# EAGLE schematic ComputeCalculator (EAGLE 7.2.0)

## Sheet 1 of 5
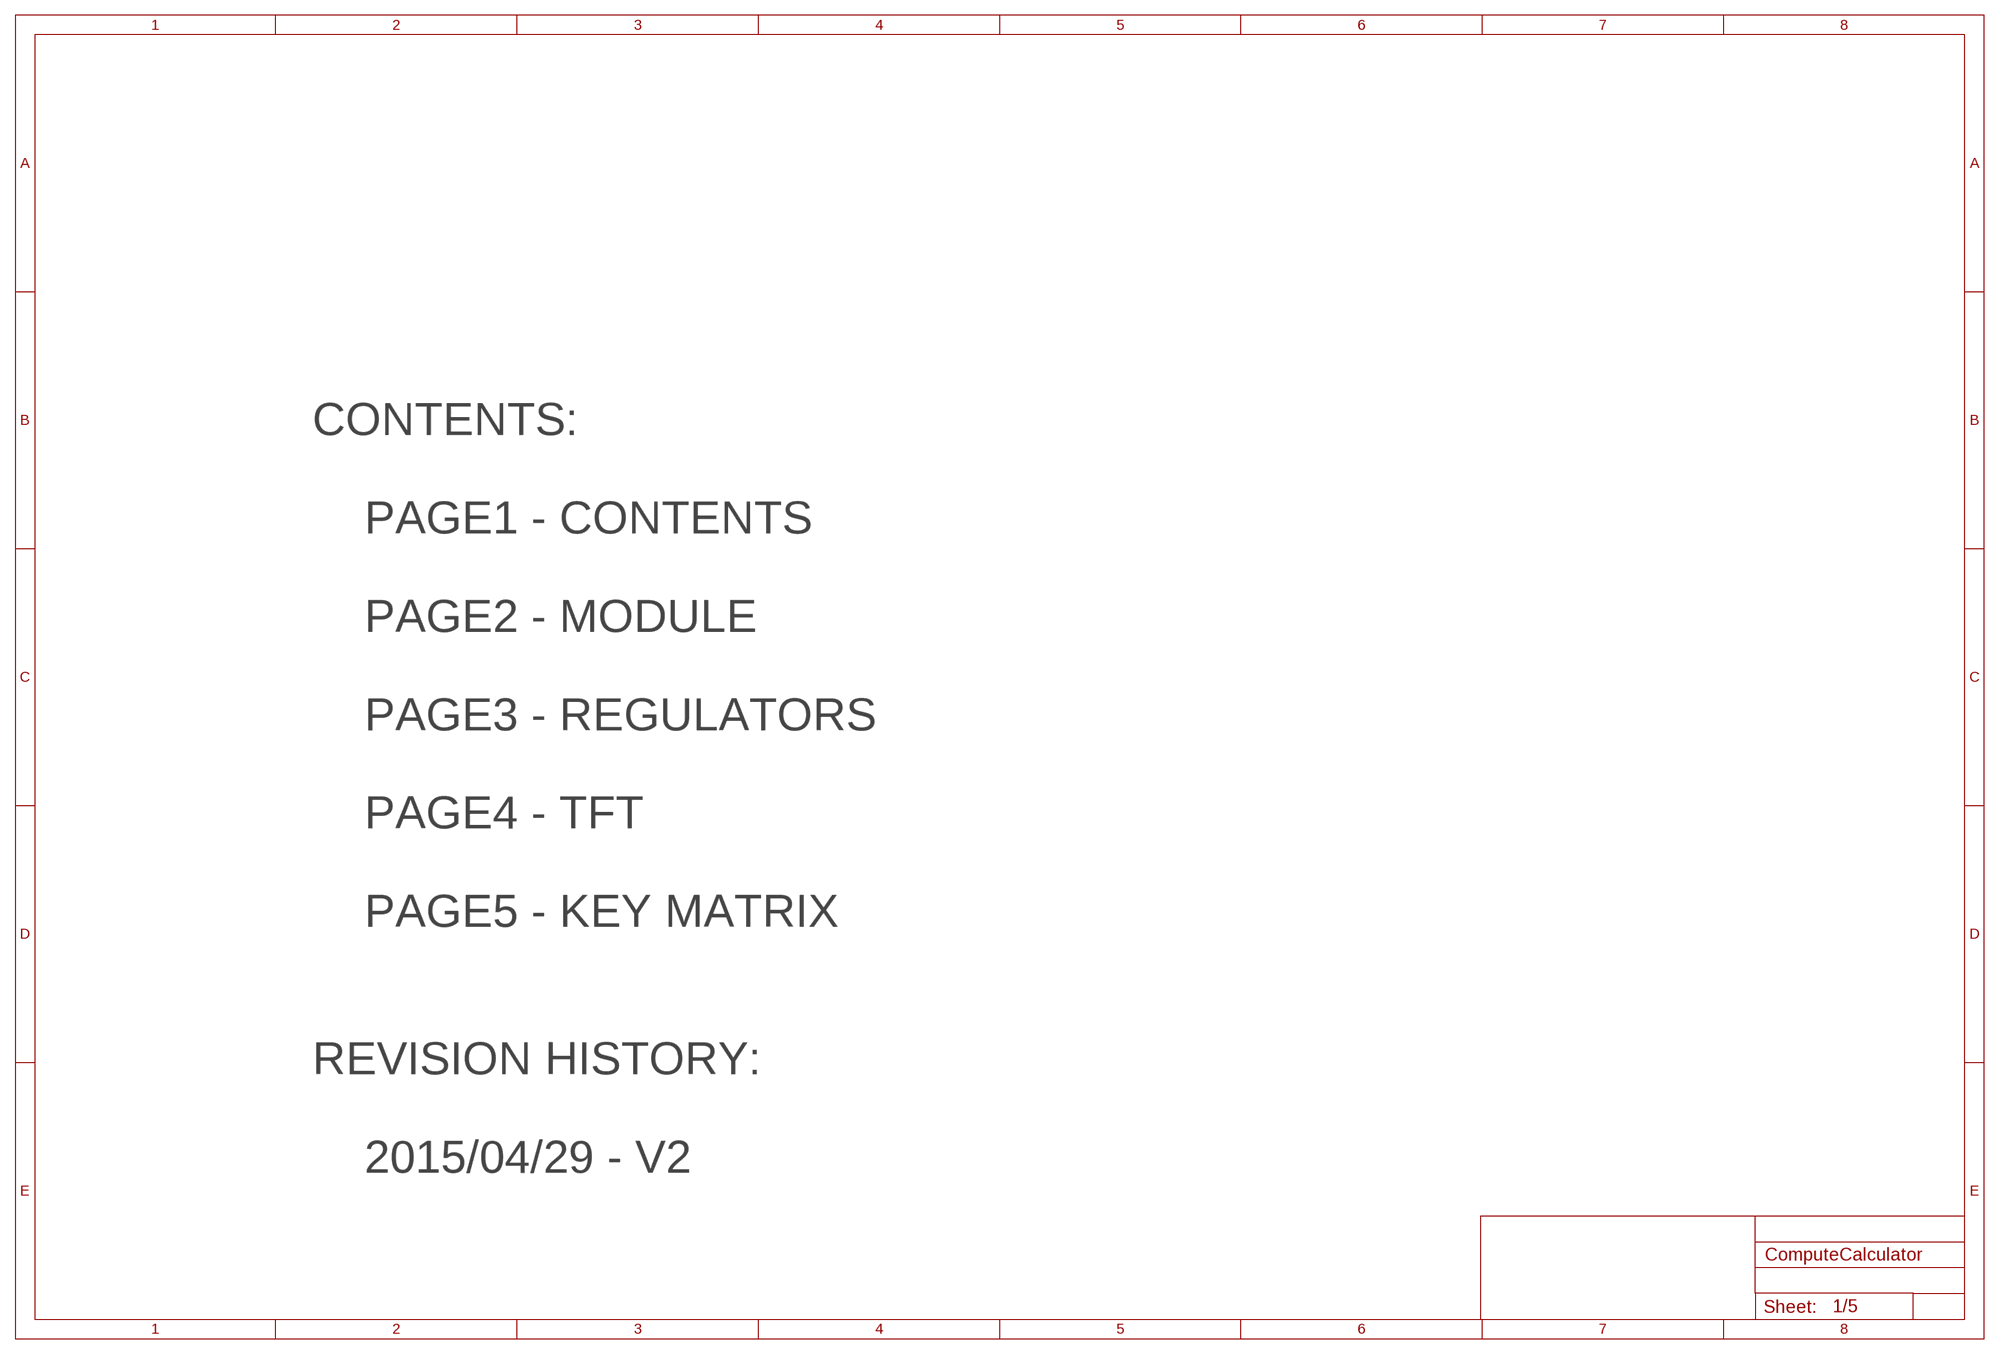
[diagram p0: schematic, sheet 1]

### Notes on the sheet
- CONTENTS:
  
      PAGE1 - CONTENTS
  
      PAGE2 - MODULE
  
      PAGE3 - REGULATORS
  
      PAGE4 - TFT
   
      PAGE5 - KEY MATRIX
  
  
  REVISION HISTORY:
  
      2015/04/29 - V2

## Sheet 2 of 5
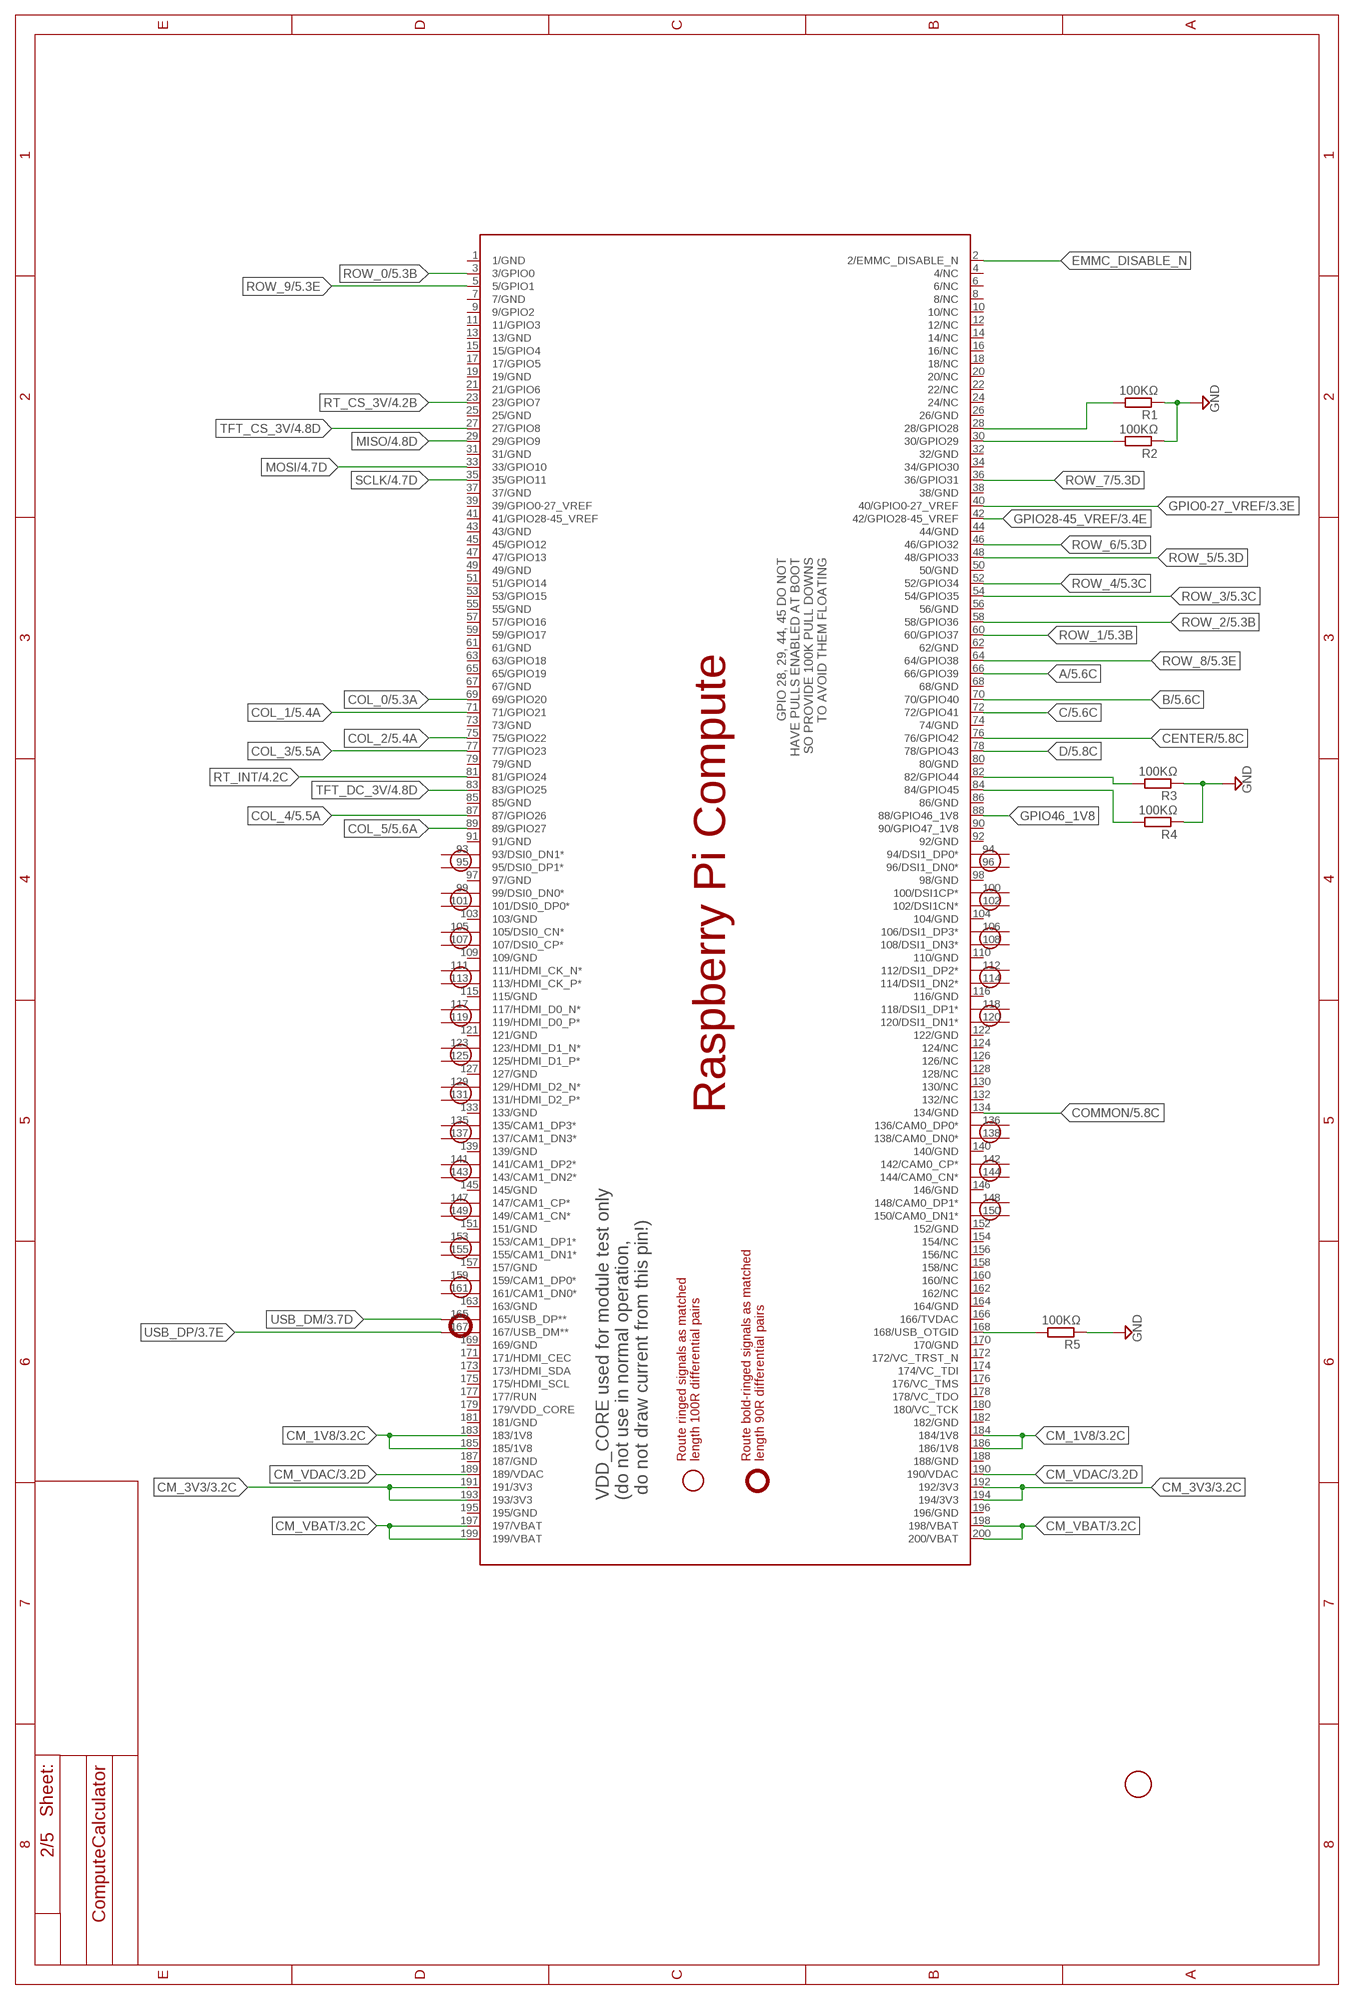
[diagram p1: schematic, sheet 2]

### Parts
$$PCB100  RPI_COMPUTE  [RPI_COMPUTE]
$$U$1  FIDUCIAL  [FIDUCIAL_1MM]
R1  100KΩ  R-EU_M1206  [M1206]
R2  100KΩ  R-EU_M1206  [M1206]
R3  100KΩ  R-EU_M1206  [M1206]
R4  100KΩ  R-EU_M1206  [M1206]
R5  100KΩ  R-EU_M1206  [M1206]

### Nets
A: $$PCB100.66(66/GPIO39) ; also sheet 5
B: $$PCB100.70(70/GPIO40) ; also sheet 5
C: $$PCB100.72(72/GPIO41) ; also sheet 5
CENTER: $$PCB100.76(76/GPIO42) ; also sheet 5
CM_1V8: $$PCB100.183(183/1V8) $$PCB100.184(184/1V8) $$PCB100.185(185/1V8) $$PCB100.186(186/1V8) ; also sheet 3
CM_3V3: $$PCB100.191(191/3V3) $$PCB100.192(192/3V3) $$PCB100.193(193/3V3) $$PCB100.194(194/3V3) ; also sheet 3
CM_VBAT: $$PCB100.197(197/VBAT) $$PCB100.198(198/VBAT) $$PCB100.199(199/VBAT) $$PCB100.200(200/VBAT) ; also sheet 3
CM_VDAC: $$PCB100.189(189/VDAC) $$PCB100.190(190/VDAC) ; also sheet 3
COL_0: $$PCB100.69(69/GPIO20) ; also sheet 5
COL_1: $$PCB100.71(71/GPIO21) ; also sheet 5
COL_2: $$PCB100.75(75/GPIO22) ; also sheet 5
COL_3: $$PCB100.77(77/GPIO23) ; also sheet 5
COL_4: $$PCB100.87(87/GPIO26) ; also sheet 5
COL_5: $$PCB100.89(89/GPIO27) ; also sheet 5
COMMON: $$PCB100.134(134/GND) ; also sheet 5
D: $$PCB100.78(78/GPIO43) ; also sheet 5
EMMC_DISABLE_N: $$PCB100.2(2/EMMC_DISABLE_N)
GND: R1.1 R2.1 R3.1 R4.1 R5.1 ; also sheet 3,4
GPIO0-27_VREF: $$PCB100.40(40/GPIO0-27_VREF) ; also sheet 3
GPIO28-45_VREF: $$PCB100.42(42/GPIO28-45_VREF) ; also sheet 3
GPIO46_1V8: $$PCB100.88(88/GPIO46_1V8)
MISO: $$PCB100.29(29/GPIO9) ; also sheet 4
MOSI: $$PCB100.33(33/GPIO10) ; also sheet 4
N$19: $$PCB100.28(28/GPIO28) R1.2
N$24: $$PCB100.82(82/GPIO44) R3.2
N$25: $$PCB100.84(84/GPIO45) R4.2
N$30: $$PCB100.168(168/USB_OTGID) R5.2
N$31: $$PCB100.30(30/GPIO29) R2.2
ROW_0: $$PCB100.3(3/GPIO0) ; also sheet 5
ROW_1: $$PCB100.60(60/GPIO37) ; also sheet 5
ROW_2: $$PCB100.58(58/GPIO36) ; also sheet 5
ROW_3: $$PCB100.54(54/GPIO35) ; also sheet 5
ROW_4: $$PCB100.52(52/GPIO34) ; also sheet 5
ROW_5: $$PCB100.48(48/GPIO33) ; also sheet 5
ROW_6: $$PCB100.46(46/GPIO32) ; also sheet 5
ROW_7: $$PCB100.36(36/GPIO31) ; also sheet 5
ROW_8: $$PCB100.64(64/GPIO38) ; also sheet 5
ROW_9: $$PCB100.5(5/GPIO1) ; also sheet 5
RT_CS_3V: $$PCB100.23(23/GPIO7) ; also sheet 4
RT_INT: $$PCB100.81(81/GPIO24) ; also sheet 4
SCLK: $$PCB100.35(35/GPIO11) ; also sheet 4
TFT_CS_3V: $$PCB100.27(27/GPIO8) ; also sheet 4
TFT_DC_3V: $$PCB100.83(83/GPIO25) ; also sheet 4
USB_DM: $$PCB100.165(165/USB_DP**) ; also sheet 3
USB_DP: $$PCB100.167(167/USB_DM**) ; also sheet 3
Unconnected: $$PCB100.1(1/GND) $$PCB100.4(4/NC) $$PCB100.6(6/NC) $$PCB100.7(7/GND) $$PCB100.8(8/NC) $$PCB100.9(9/GPIO2) $$PCB100.10(10/NC) $$PCB100.11(11/GPIO3) $$PCB100.12(12/NC) $$PCB100.13(13/GND) $$PCB100.14(14/NC) $$PCB100.15(15/GPIO4) $$PCB100.16(16/NC) $$PCB100.17(17/GPIO5) $$PCB100.18(18/NC) $$PCB100.19(19/GND) $$PCB100.20(20/NC) $$PCB100.21(21/GPIO6) $$PCB100.22(22/NC) $$PCB100.24(24/NC) $$PCB100.25(25/GND) $$PCB100.26(26/GND) $$PCB100.31(31/GND) $$PCB100.32(32/GND) $$PCB100.34(34/GPIO30) $$PCB100.37(37/GND) $$PCB100.38(38/GND) $$PCB100.39(39/GPIO0-27_VREF) $$PCB100.41(41/GPIO28-45_VREF) $$PCB100.43(43/GND) $$PCB100.44(44/GND) $$PCB100.45(45/GPIO12) $$PCB100.47(47/GPIO13) $$PCB100.49(49/GND) $$PCB100.50(50/GND) $$PCB100.51(51/GPIO14) $$PCB100.53(53/GPIO15) $$PCB100.55(55/GND) $$PCB100.56(56/GND) $$PCB100.57(57/GPIO16) $$PCB100.59(59/GPIO17) $$PCB100.61(61/GND) $$PCB100.62(62/GND) $$PCB100.63(63/GPIO18) $$PCB100.65(65/GPIO19) $$PCB100.67(67/GND) $$PCB100.68(68/GND) $$PCB100.73(73/GND) $$PCB100.74(74/GND) $$PCB100.79(79/GND) $$PCB100.80(80/GND) $$PCB100.85(85/GND) $$PCB100.86(86/GND) $$PCB100.90(90/GPIO47_1V8) $$PCB100.91(91/GND) $$PCB100.92(92/GND) $$PCB100.93(93/DSI0_DN1*) $$PCB100.94(94/DSI1_DP0*) $$PCB100.95(95/DSI0_DP1*) $$PCB100.96(96/DSI1_DN0*) $$PCB100.97(97/GND) $$PCB100.98(98/GND) $$PCB100.99(99/DSI0_DN0*) $$PCB100.100(100/DSI1CP*) $$PCB100.101(101/DSI0_DP0*) $$PCB100.102(102/DSI1CN*) $$PCB100.103(103/GND) $$PCB100.104(104/GND) $$PCB100.105(105/DSI0_CN*) $$PCB100.106(106/DSI1_DP3*) $$PCB100.107(107/DSI0_CP*) $$PCB100.108(108/DSI1_DN3*) $$PCB100.109(109/GND) $$PCB100.110(110/GND) $$PCB100.111(111/HDMI_CK_N*) $$PCB100.112(112/DSI1_DP2*) $$PCB100.113(113/HDMI_CK_P*) $$PCB100.114(114/DSI1_DN2*) $$PCB100.115(115/GND) $$PCB100.116(116/GND) $$PCB100.117(117/HDMI_D0_N*) $$PCB100.118(118/DSI1_DP1*) $$PCB100.119(119/HDMI_D0_P*) $$PCB100.120(120/DSI1_DN1*) $$PCB100.121(121/GND) $$PCB100.122(122/GND) $$PCB100.123(123/HDMI_D1_N*) $$PCB100.124(124/NC) $$PCB100.125(125/HDMI_D1_P*) $$PCB100.126(126/NC) $$PCB100.127(127/GND) $$PCB100.128(128/NC) $$PCB100.129(129/HDMI_D2_N*) $$PCB100.130(130/NC) $$PCB100.131(131/HDMI_D2_P*) $$PCB100.132(132/NC) $$PCB100.133(133/GND) $$PCB100.135(135/CAM1_DP3*) $$PCB100.136(136/CAM0_DP0*) $$PCB100.137(137/CAM1_DN3*) $$PCB100.138(138/CAM0_DN0*) $$PCB100.139(139/GND) $$PCB100.140(140/GND) $$PCB100.141(141/CAM1_DP2*) $$PCB100.142(142/CAM0_CP*) $$PCB100.143(143/CAM1_DN2*) $$PCB100.144(144/CAM0_CN*) $$PCB100.145(145/GND) $$PCB100.146(146/GND) $$PCB100.147(147/CAM1_CP*) $$PCB100.148(148/CAM0_DP1*) $$PCB100.149(149/CAM1_CN*) $$PCB100.150(150/CAM0_DN1*) $$PCB100.151(151/GND) $$PCB100.152(152/GND) $$PCB100.153(153/CAM1_DP1*) $$PCB100.154(154/NC) $$PCB100.155(155/CAM1_DN1*) $$PCB100.156(156/NC) $$PCB100.157(157/GND) $$PCB100.158(158/NC) $$PCB100.159(159/CAM1_DP0*) $$PCB100.160(160/NC) $$PCB100.161(161/CAM1_DN0*) $$PCB100.162(162/NC) $$PCB100.163(163/GND) $$PCB100.164(164/GND) $$PCB100.166(166/TVDAC) $$PCB100.169(169/GND) $$PCB100.170(170/GND) $$PCB100.171(171/HDMI_CEC) $$PCB100.172(172/VC_TRST_N) $$PCB100.173(173/HDMI_SDA) $$PCB100.174(174/VC_TDI) $$PCB100.175(175/HDMI_SCL) $$PCB100.176(176/VC_TMS) $$PCB100.177(177/RUN) $$PCB100.178(178/VC_TDO) $$PCB100.179(179/VDD_CORE) $$PCB100.180(180/VC_TCK) $$PCB100.181(181/GND) $$PCB100.182(182/GND) $$PCB100.187(187/GND) $$PCB100.188(188/GND) $$PCB100.195(195/GND) $$PCB100.196(196/GND)

### Notes on the sheet
- GPIO 28, 29, 44, 45 DO NOT
  HAVE PULLS ENABLED AT BOOT
  SO PROVIDE 100K PULL DOWNS
  TO AVOID THEM FLOATING
- VDD_CORE used for module test only
  (do not use in normal operation,
   do not draw current from this pin!)

## Sheet 3 of 5
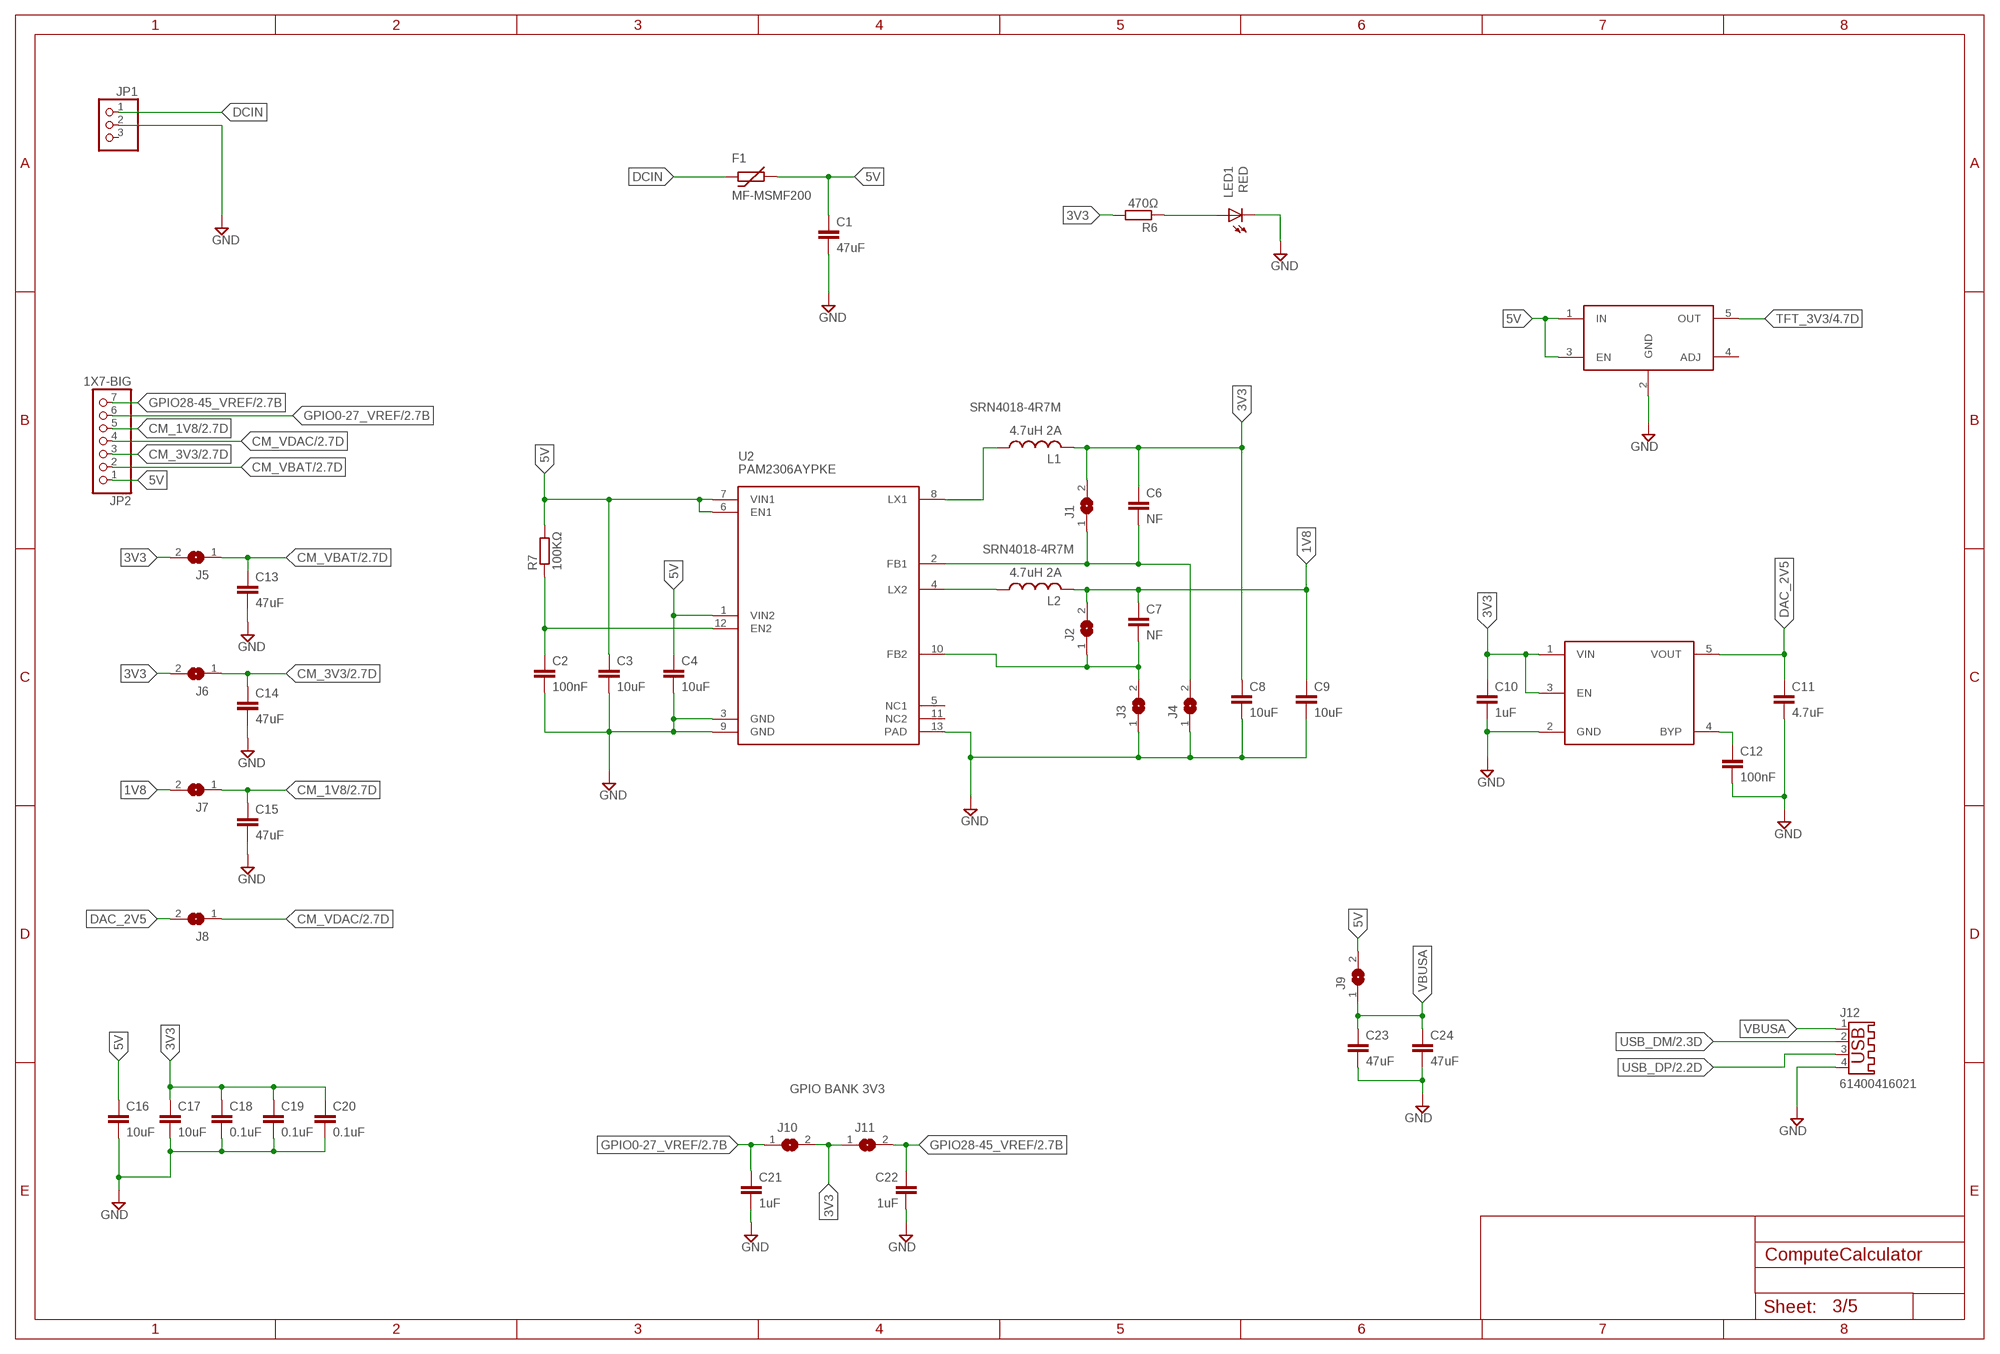
[diagram p2: schematic, sheet 3]

### Parts
C1  47uF  CAPACITOR  [C0603]
C2  100nF  C-EUC1206  [C1206]
C3  10uF  C-EUC1206  [C1206]
C4  10uF  C-EUC1206  [C1206]
C6  NF  C-EUC1206  [C1206]
C7  NF  C-EUC1206  [C1206]
C8  10uF  C-EUC1206  [C1206]
C9  10uF  C-EUC1206  [C1206]
C10  1uF  C-EUC1206  [C1206]
C11  4.7uF  C-EUC1206  [C1206]
C12  100nF  C-EUC1206  [C1206]
C13  47uF  C-EUC1206  [C1206]
C14  47uF  C-EUC1206  [C1206]
C15  47uF  C-EUC1206  [C1206]
C16  10uF  C-EUC1206  [C1206]
C17  10uF  C-EUC1206  [C1206]
C18  0.1uF  C-EUC1206  [C1206]
C19  0.1uF  C-EUC1206  [C1206]
C20  0.1uF  C-EUC1206  [C1206]
C21  1uF  C-EUC1206  [C1206]
C22  1uF  C-EUC1206  [C1206]
C23  47uF  C-EUC1206  [C1206]
C24  47uF  C-EUC1206  [C1206]
F1  MF-MSMF200  [MF-MSMF200]
J1  JUMPER  [SJW]
J2  JUMPER  [SJW]
J3  JUMPER  [SJW]
J4  JUMPER  [SJW]
J5  JUMPER  [SJW]
J6  JUMPER  [SJW]
J7  JUMPER  [SJW]
J8  JUMPER  [SJW]
J9  JUMPER  [SJW]
J10  JUMPER  [SJW]
J11  JUMPER  [SJW]
J12  61400416021  USB-A003  [USB-A003]
JP1  PINHD-1X3  [1X03]
JP2  1X7-BIG  [1X7-BIG]
L1  SRN4018-4R7M  L-USWE-TPC  [POWER-CHOKE_WE-TPC]
L2  SRN4018-4R7M  L-USWE-TPC  [POWER-CHOKE_WE-TPC]
LED1  RED  LEDCHIP-LED0805  [CHIP-LED0805]
R6  470Ω  R-EU_M1206  [M1206]
R7  100KΩ  R-EU_M1206  [M1206]
U1  MIC5225  [SOT-25]
U2  PAM2306AYPKE  [WDFN_12L]
U3  AP7115-25SEG  [SOT-25]

### Nets
1V8: C7.1 C9.1 J2.2 J7.2 L2.2
3V3: C6.1 C8.1 C10.1 C17.1 C18.1 C19.1 C20.1 J1.2 J5.2 J6.2 J10.2 J11.1 L1.2 R6.2 U3.1(VIN) U3.3(EN)
5V: C1.1 C3.1 C4.1 C16.1 F1.P$2 J9.2 JP2.1 R7.2 U1.1(IN) U1.3(EN) U2.1(VIN2) U2.6(EN1) U2.7(VIN1)
CM_1V8: C15.1 J7.1 JP2.5 ; also sheet 2
CM_3V3: C14.1 J6.1 JP2.3 ; also sheet 2
CM_VBAT: C13.1 J5.1 JP2.2 ; also sheet 2
CM_VDAC: J8.1 JP2.4 ; also sheet 2
DAC_2V5: C11.1 J8.2 U3.5(VOUT)
DCIN: F1.P$1 JP1.1
GND: C1.2 C2.2 C3.2 C4.2 C8.2 C9.2 C10.2 C11.2 C12.2 C13.2 C14.2 C15.2 C16.2 C17.2 C18.2 C19.2 C20.2 C21.2 C22.2 C23.2 C24.2 J3.1 J4.1 J12.4 JP1.2 LED1.C U1.2(GND) U2.3(GND) U2.9(GND) U2.13(PAD) U3.2(GND) ; also sheet 2,4
GPIO0-27_VREF: C21.1 J10.1 JP2.6 ; also sheet 2
GPIO28-45_VREF: C22.1 J11.2 JP2.7 ; also sheet 2
N$1: C6.2 J1.1 J4.2 U2.2(FB1)
N$2: LED1.A R6.1
N$3: C2.1 R7.1 U2.12(EN2)
N$5: C7.2 J2.1 J3.2 U2.10(FB2)
N$6: L1.1 U2.8(LX1)
N$7: L2.1 U2.4(LX2)
N$9: C12.1 U3.4(BYP)
TFT_3V3: U1.5(OUT) ; also sheet 4
USB_DM: J12.2 ; also sheet 2
USB_DP: J12.3 ; also sheet 2
VBUSA: C23.1 C24.1 J9.1 J12.1
Unconnected: JP1.3 U1.4(ADJ) U2.5(NC1) U2.11(NC2)

### Notes on the sheet
- 4.7uH 2A
- 4.7uH 2A
- GPIO BANK 3V3

## Sheet 4 of 5
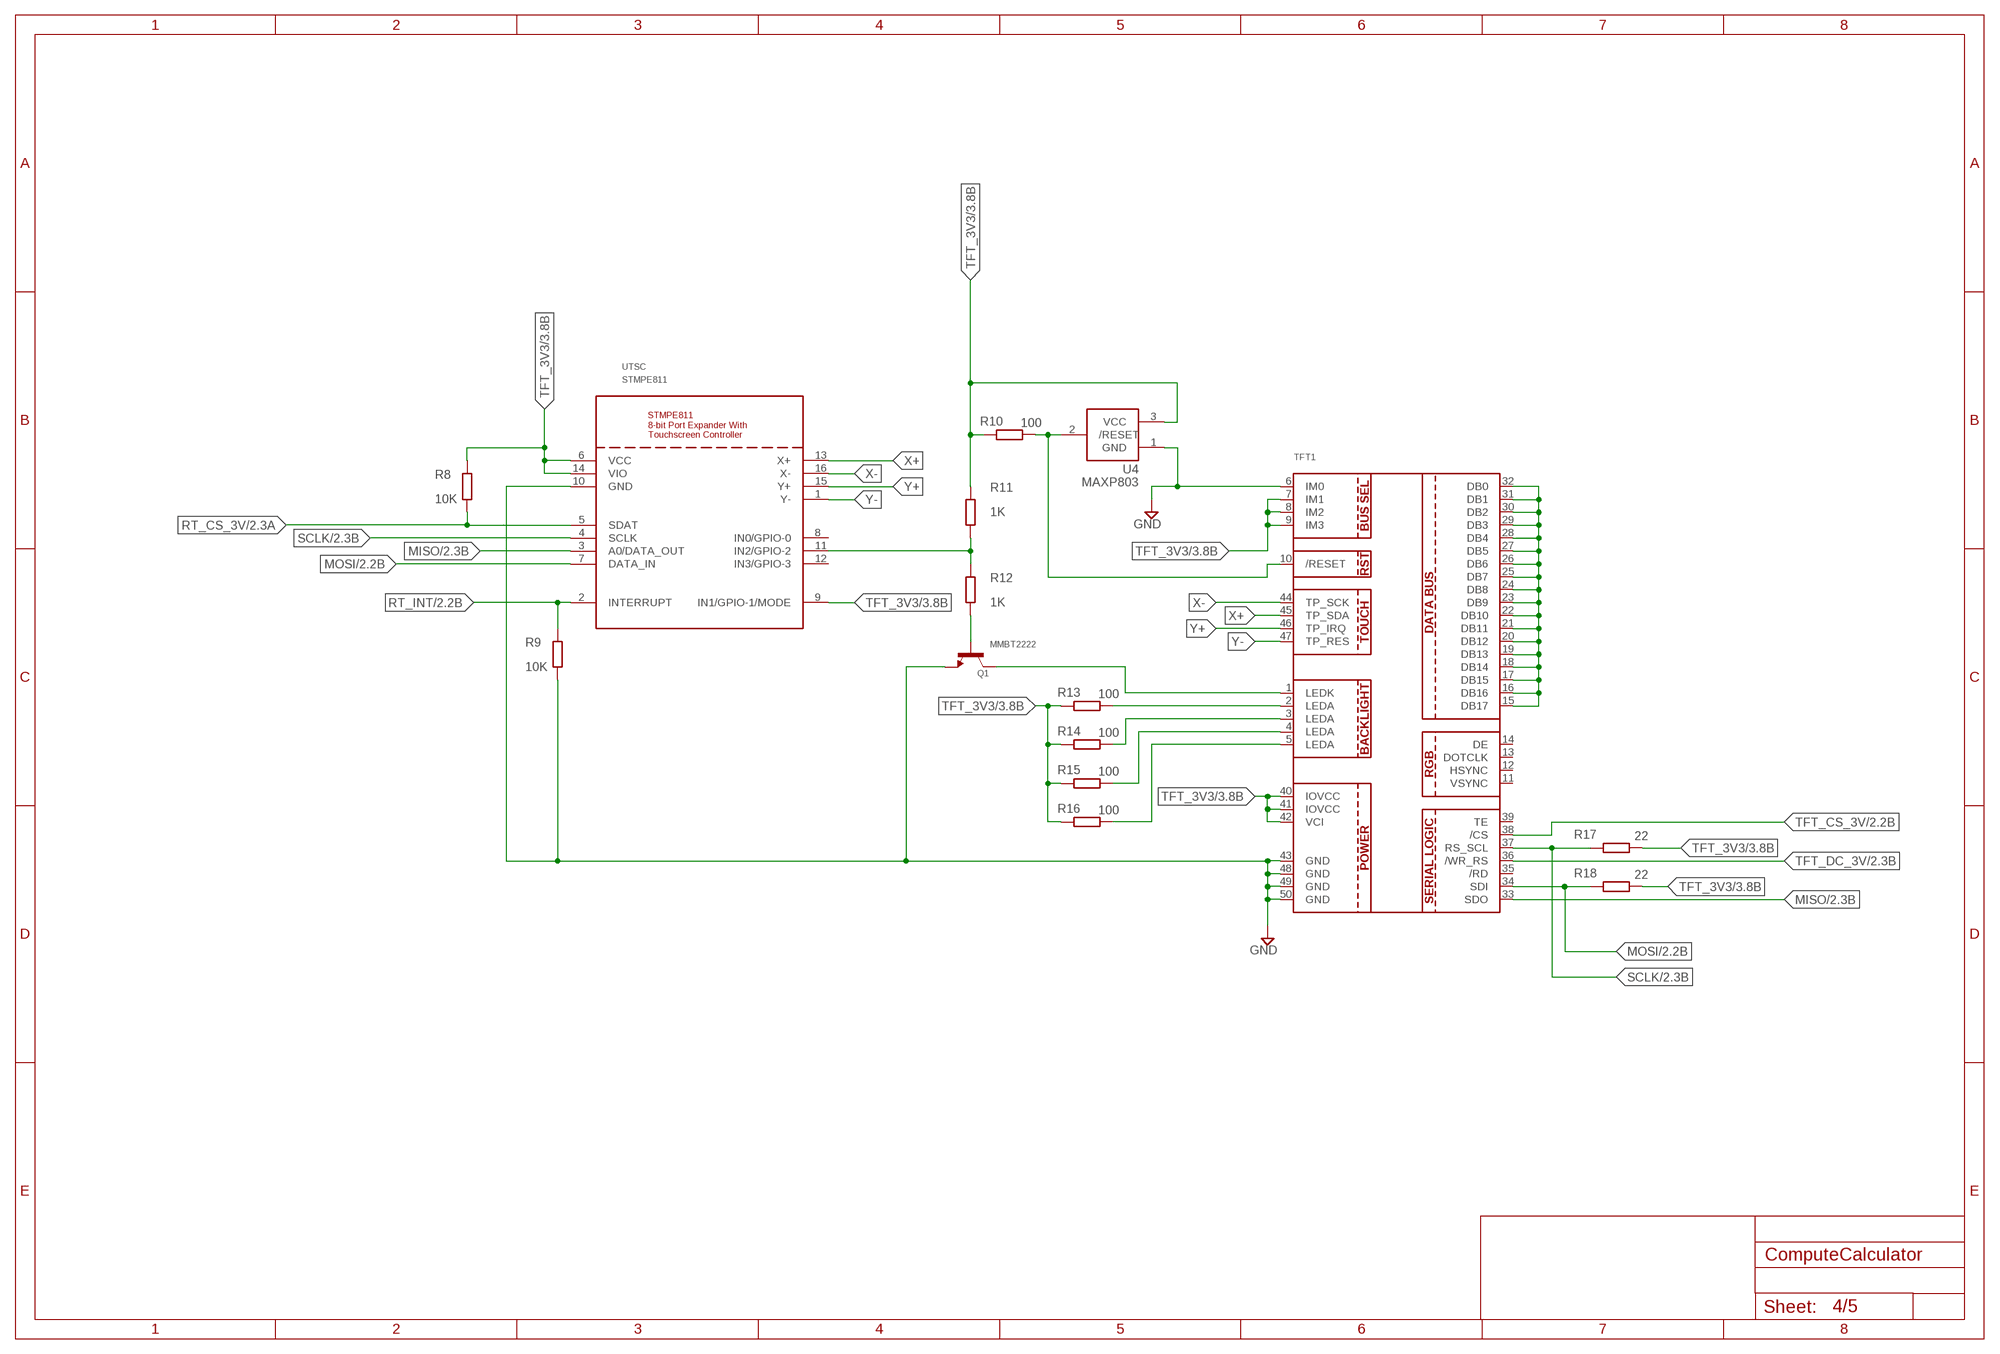
[diagram p3: schematic, sheet 4]

### Parts
Q1  MMBT2222  TRANSISTOR_NPNWIDE  [SOT23-WIDE]
R8  10K  R-EU_M1206  [M1206]
R9  10K  R-EU_M1206  [M1206]
R10  100  R-EU_M1206  [M1206]
R11  1K  R-EU_M1206  [M1206]
R12  1K  R-EU_M1206  [M1206]
R13  100  R-EU_M1206  [M1206]
R14  100  R-EU_M1206  [M1206]
R15  100  R-EU_M1206  [M1206]
R16  100  R-EU_M1206  [M1206]
R17  22  R-EU_M1206  [M1206]
R18  22  R-EU_M1206  [M1206]
TFT1  DISP_LCD_CTP28_DATASHEET  [TFT_CTP28]
U4  MAXP803  AXP083-SAG  [SOT23]
UTSC  STMPE811  [QFN16L]

### Nets
GND: Q1.2(E) R9.2 TFT1.6(IM0) TFT1.43(GND) TFT1.48(GND) TFT1.49(GND) TFT1.50(GND) U4.1(GND) UTSC.10(GND) ; also sheet 2,3
MISO: TFT1.33(SDO) UTSC.3(A0/DATA_OUT) ; also sheet 2
MOSI: R18.2 TFT1.34(SDI) UTSC.7(DATA_IN) ; also sheet 2
N$8: Q1.3(C) TFT1.1(LEDK)
N$11: R11.2 R12.1 UTSC.11(IN2/GPIO-2)
N$12: Q1.1(B) R12.2
N$26: R13.1 TFT1.2(LEDA)
N$27: R14.1 TFT1.3(LEDA)
N$28: R15.1 TFT1.4(LEDA)
N$32: TFT1.15(DB17) TFT1.16(DB16) TFT1.17(DB15) TFT1.18(DB14) TFT1.19(DB13) TFT1.20(DB12) TFT1.21(DB11) TFT1.22(DB10) TFT1.23(DB9) TFT1.24(DB8) TFT1.25(DB7) TFT1.26(DB6) TFT1.27(DB5) TFT1.28(DB4) TFT1.29(DB3) TFT1.30(DB2) TFT1.31(DB1) TFT1.32(DB0)
R16: R16.1 TFT1.5(LEDA)
RT_CS_3V: R8.2 UTSC.5(SDAT) ; also sheet 2
RT_INT: R9.1 UTSC.2(INTERRUPT) ; also sheet 2
SCLK: R17.2 TFT1.37(RS_SCL) UTSC.4(SCLK) ; also sheet 2
TFT_3V3: R8.1 R10.2 R11.1 R13.2 R14.2 R15.2 R16.2 R17.1 R18.1 TFT1.7(IM1) TFT1.8(IM2) TFT1.9(IM3) TFT1.40(IOVCC) TFT1.41(IOVCC) TFT1.42(VCI) U4.3(VCC) UTSC.6(VCC) UTSC.9(IN1/GPIO-1/MODE) UTSC.14(VIO) ; also sheet 3
TFT_CS_3V: TFT1.38(/CS) ; also sheet 2
TFT_DC_3V: TFT1.36(/WR_RS) ; also sheet 2
TFT_RESET: R10.1 TFT1.10(/RESET) U4.2(/RESET)
X+: TFT1.45(TP_SDA) UTSC.13(X+)
X-: TFT1.44(TP_SCK) UTSC.16(X-)
Y+: TFT1.46(TP_IRQ) UTSC.15(Y+)
Y-: TFT1.47(TP_RES) UTSC.1(Y-)
Unconnected: TFT1.11(VSYNC) TFT1.12(HSYNC) TFT1.13(DOTCLK) TFT1.14(DE) TFT1.35(/RD) TFT1.39(TE) UTSC.8(IN0/GPIO-0) UTSC.12(IN3/GPIO-3)

## Sheet 5 of 5
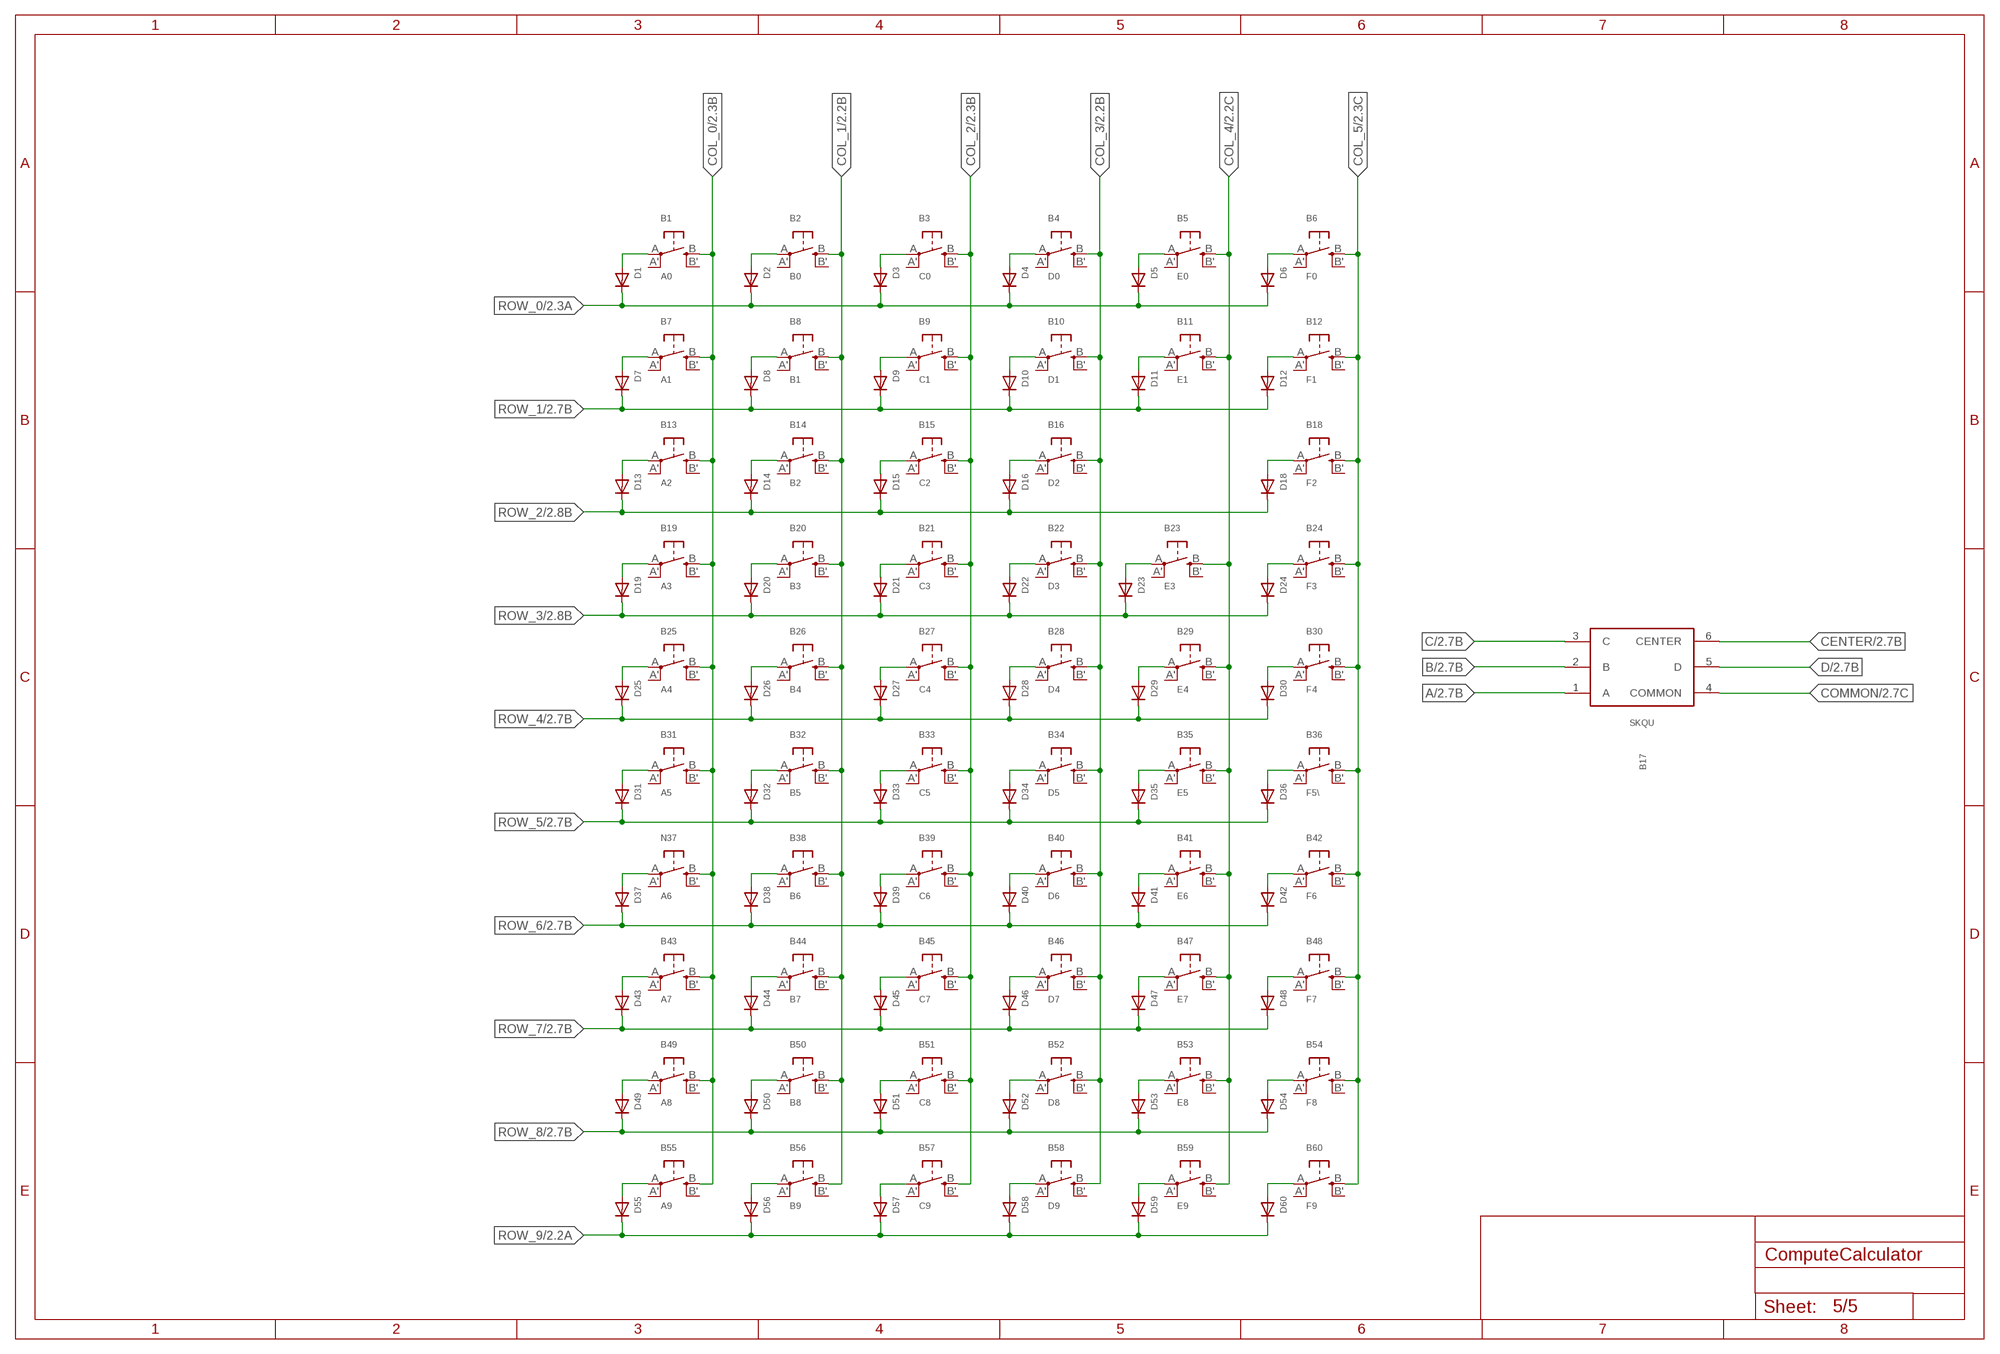
[diagram p4: schematic, sheet 5]

### Parts
B1  A0  SWITCH_TACT_SMT  [EVQ-Q2]
B2  B0  SWITCH_TACT_SMT  [EVQ-Q2]
B3  C0  SWITCH_TACT_SMT  [EVQ-Q2]
B4  D0  SWITCH_TACT_SMT  [EVQ-Q2]
B5  E0  SWITCH_TACT_SMT  [EVQ-Q2]
B6  F0  SWITCH_TACT_SMT  [EVQ-Q2]
B7  A1  SWITCH_TACT_SMT  [EVQ-Q2]
B8  B1  SWITCH_TACT_SMT  [EVQ-Q2]
B9  C1  SWITCH_TACT_SMT  [EVQ-Q2]
B10  D1  SWITCH_TACT_SMT  [EVQ-Q2]
B11  E1  SWITCH_TACT_SMT  [EVQ-Q2]
B12  F1  SWITCH_TACT_SMT  [EVQ-Q2]
B13  A2  SWITCH_TACT_SMT  [EVQ-Q2]
B14  B2  SWITCH_TACT_SMT  [EVQ-Q2]
B15  C2  SWITCH_TACT_SMT  [EVQ-Q2]
B16  D2  SWITCH_TACT_SMT  [EVQ-Q2]
B17  SKQU  [SKQU]
B18  F2  SWITCH_TACT_SMT  [EVQ-Q2]
B19  A3  SWITCH_TACT_SMT  [EVQ-Q2]
B20  B3  SWITCH_TACT_SMT  [EVQ-Q2]
B21  C3  SWITCH_TACT_SMT  [EVQ-Q2]
B22  D3  SWITCH_TACT_SMT  [EVQ-Q2]
B23  E3  SWITCH_TACT_SMT  [EVQ-Q2]
B24  F3  SWITCH_TACT_SMT  [EVQ-Q2]
B25  A4  SWITCH_TACT_SMT  [EVQ-Q2]
B26  B4  SWITCH_TACT_SMT  [EVQ-Q2]
B27  C4  SWITCH_TACT_SMT  [EVQ-Q2]
B28  D4  SWITCH_TACT_SMT  [EVQ-Q2]
B29  E4  SWITCH_TACT_SMT  [EVQ-Q2]
B30  F4  SWITCH_TACT_SMT  [EVQ-Q2]
B31  A5  SWITCH_TACT_SMT  [EVQ-Q2]
B32  B5  SWITCH_TACT_SMT  [EVQ-Q2]
B33  C5  SWITCH_TACT_SMT  [EVQ-Q2]
B34  D5  SWITCH_TACT_SMT  [EVQ-Q2]
B35  E5  SWITCH_TACT_SMT  [EVQ-Q2]
B36  F5\  SWITCH_TACT_SMT  [EVQ-Q2]
B38  B6  SWITCH_TACT_SMT  [EVQ-Q2]
B39  C6  SWITCH_TACT_SMT  [EVQ-Q2]
B40  D6  SWITCH_TACT_SMT  [EVQ-Q2]
B41  E6  SWITCH_TACT_SMT  [EVQ-Q2]
B42  F6  SWITCH_TACT_SMT  [EVQ-Q2]
B43  A7  SWITCH_TACT_SMT  [EVQ-Q2]
B44  B7  SWITCH_TACT_SMT  [EVQ-Q2]
B45  C7  SWITCH_TACT_SMT  [EVQ-Q2]
B46  D7  SWITCH_TACT_SMT  [EVQ-Q2]
B47  E7  SWITCH_TACT_SMT  [EVQ-Q2]
B48  F7  SWITCH_TACT_SMT  [EVQ-Q2]
B49  A8  SWITCH_TACT_SMT  [EVQ-Q2]
B50  B8  SWITCH_TACT_SMT  [EVQ-Q2]
B51  C8  SWITCH_TACT_SMT  [EVQ-Q2]
B52  D8  SWITCH_TACT_SMT  [EVQ-Q2]
B53  E8  SWITCH_TACT_SMT  [EVQ-Q2]
B54  F8  SWITCH_TACT_SMT  [EVQ-Q2]
B55  A9  SWITCH_TACT_SMT  [EVQ-Q2]
B56  B9  SWITCH_TACT_SMT  [EVQ-Q2]
B57  C9  SWITCH_TACT_SMT  [EVQ-Q2]
B58  D9  SWITCH_TACT_SMT  [EVQ-Q2]
B59  E9  SWITCH_TACT_SMT  [EVQ-Q2]
B60  F9  SWITCH_TACT_SMT  [EVQ-Q2]
D1  DIODESMA  [SMADIODE]
D2  DIODESMA  [SMADIODE]
D3  DIODESMA  [SMADIODE]
D4  DIODESMA  [SMADIODE]
D5  DIODESMA  [SMADIODE]
D6  DIODESMA  [SMADIODE]
D7  DIODESMA  [SMADIODE]
D8  DIODESMA  [SMADIODE]
D9  DIODESMA  [SMADIODE]
D10  DIODESMA  [SMADIODE]
D11  DIODESMA  [SMADIODE]
D12  DIODESMA  [SMADIODE]
D13  DIODESMA  [SMADIODE]
D14  DIODESMA  [SMADIODE]
D15  DIODESMA  [SMADIODE]
D16  DIODESMA  [SMADIODE]
D18  DIODESMA  [SMADIODE]
D19  DIODESMA  [SMADIODE]
D20  DIODESMA  [SMADIODE]
D21  DIODESMA  [SMADIODE]
D22  DIODESMA  [SMADIODE]
D23  DIODESMA  [SMADIODE]
D24  DIODESMA  [SMADIODE]
D25  DIODESMA  [SMADIODE]
D26  DIODESMA  [SMADIODE]
D27  DIODESMA  [SMADIODE]
D28  DIODESMA  [SMADIODE]
D29  DIODESMA  [SMADIODE]
D30  DIODESMA  [SMADIODE]
D31  DIODESMA  [SMADIODE]
D32  DIODESMA  [SMADIODE]
D33  DIODESMA  [SMADIODE]
D34  DIODESMA  [SMADIODE]
D35  DIODESMA  [SMADIODE]
D36  DIODESMA  [SMADIODE]
D37  DIODESMA  [SMADIODE]
D38  DIODESMA  [SMADIODE]
D39  DIODESMA  [SMADIODE]
D40  DIODESMA  [SMADIODE]
D41  DIODESMA  [SMADIODE]
D42  DIODESMA  [SMADIODE]
D43  DIODESMA  [SMADIODE]
D44  DIODESMA  [SMADIODE]
D45  DIODESMA  [SMADIODE]
D46  DIODESMA  [SMADIODE]
D47  DIODESMA  [SMADIODE]
D48  DIODESMA  [SMADIODE]
D49  DIODESMA  [SMADIODE]
D50  DIODESMA  [SMADIODE]
D51  DIODESMA  [SMADIODE]
D52  DIODESMA  [SMADIODE]
D53  DIODESMA  [SMADIODE]
D54  DIODESMA  [SMADIODE]
D55  DIODESMA  [SMADIODE]
D56  DIODESMA  [SMADIODE]
D57  DIODESMA  [SMADIODE]
D58  DIODESMA  [SMADIODE]
D59  DIODESMA  [SMADIODE]
D60  DIODESMA  [SMADIODE]
N37  A6  SWITCH_TACT_SMT  [EVQ-Q2]

### Nets
A: B17.1(A) ; also sheet 2
B: B17.2(B) ; also sheet 2
C: B17.3(C) ; also sheet 2
CENTER: B17.6(CENTER) ; also sheet 2
COL_0: B1.B(S) B7.B(S) B13.B(S) B19.B(S) B25.B(S) B31.B(S) B43.B(S) B49.B(S) B55.B(S) N37.B(S) ; also sheet 2
COL_1: B2.B(S) B8.B(S) B14.B(S) B20.B(S) B26.B(S) B32.B(S) B38.B(S) B44.B(S) B50.B(S) B56.B(S) ; also sheet 2
COL_2: B3.B(S) B9.B(S) B15.B(S) B21.B(S) B27.B(S) B33.B(S) B39.B(S) B45.B(S) B51.B(S) B57.B(S) ; also sheet 2
COL_3: B4.B(S) B10.B(S) B16.B(S) B22.B(S) B28.B(S) B34.B(S) B40.B(S) B46.B(S) B52.B(S) B58.B(S) ; also sheet 2
COL_4: B5.B(S) B11.B(S) B23.B(S) B29.B(S) B35.B(S) B41.B(S) B47.B(S) B53.B(S) B59.B(S) ; also sheet 2
COL_5: B6.B(S) B12.B(S) B18.B(S) B24.B(S) B30.B(S) B36.B(S) B42.B(S) B48.B(S) B54.B(S) B60.B(S) ; also sheet 2
COMMON: B17.4(COMMON) ; also sheet 2
D: B17.5(D) ; also sheet 2
N$23: B6.A(P) D6.A
N$40: B2.A(P) D2.A
N$41: B3.A(P) D3.A
N$42: B1.A(P) D1.A
N$44: B4.A(P) D4.A
N$45: B5.A(P) D5.A
N$52: B13.A(P) D13.A
N$53: B18.A(P) D18.A
N$54: B14.A(P) D14.A
N$55: B15.A(P) D15.A
N$56: B16.A(P) D16.A
N$57: B23.A(P) D23.A
N$64: B7.A(P) D7.A
N$65: B12.A(P) D12.A
N$66: B8.A(P) D8.A
N$67: B9.A(P) D9.A
N$68: B10.A(P) D10.A
N$69: B11.A(P) D11.A
N$76: B19.A(P) D19.A
N$77: B24.A(P) D24.A
N$78: B20.A(P) D20.A
N$79: B21.A(P) D21.A
N$80: B22.A(P) D22.A
N$88: B25.A(P) D25.A
N$89: B30.A(P) D30.A
N$90: B26.A(P) D26.A
N$91: B27.A(P) D27.A
N$92: B28.A(P) D28.A
N$93: B29.A(P) D29.A
N$100: B31.A(P) D31.A
N$101: B36.A(P) D36.A
N$102: B32.A(P) D32.A
N$103: B33.A(P) D33.A
N$104: B34.A(P) D34.A
N$105: B35.A(P) D35.A
N$112: D37.A N37.A(P)
N$113: B42.A(P) D42.A
N$114: B38.A(P) D38.A
N$115: B39.A(P) D39.A
N$116: B40.A(P) D40.A
N$117: B41.A(P) D41.A
N$124: B43.A(P) D43.A
N$125: B48.A(P) D48.A
N$126: B44.A(P) D44.A
N$127: B45.A(P) D45.A
N$128: B46.A(P) D46.A
N$129: B47.A(P) D47.A
N$136: B49.A(P) D49.A
N$137: B54.A(P) D54.A
N$138: B50.A(P) D50.A
N$139: B51.A(P) D51.A
N$140: B52.A(P) D52.A
N$141: B53.A(P) D53.A
N$148: B55.A(P) D55.A
N$149: B60.A(P) D60.A
N$150: B56.A(P) D56.A
N$151: B57.A(P) D57.A
N$152: B58.A(P) D58.A
N$153: B59.A(P) D59.A
ROW_0: D1.C D2.C D3.C D4.C D5.C D6.C ; also sheet 2
ROW_1: D7.C D8.C D9.C D10.C D11.C D12.C ; also sheet 2
ROW_2: D13.C D14.C D15.C D16.C D18.C ; also sheet 2
ROW_3: D19.C D20.C D21.C D22.C D23.C D24.C ; also sheet 2
ROW_4: D25.C D26.C D27.C D28.C D29.C D30.C ; also sheet 2
ROW_5: D31.C D32.C D33.C D34.C D35.C D36.C ; also sheet 2
ROW_6: D37.C D38.C D39.C D40.C D41.C D42.C ; also sheet 2
ROW_7: D43.C D44.C D45.C D46.C D47.C D48.C ; also sheet 2
ROW_8: D49.C D50.C D51.C D52.C D53.C D54.C ; also sheet 2
ROW_9: D55.C D56.C D57.C D58.C D59.C D60.C ; also sheet 2
Unconnected: B1.A'(P1) B1.B'(S1) B2.A'(P1) B2.B'(S1) B3.A'(P1) B3.B'(S1) B4.A'(P1) B4.B'(S1) B5.A'(P1) B5.B'(S1) B6.A'(P1) B6.B'(S1) B7.A'(P1) B7.B'(S1) B8.A'(P1) B8.B'(S1) B9.A'(P1) B9.B'(S1) B10.A'(P1) B10.B'(S1) B11.A'(P1) B11.B'(S1) B12.A'(P1) B12.B'(S1) B13.A'(P1) B13.B'(S1) B14.A'(P1) B14.B'(S1) B15.A'(P1) B15.B'(S1) B16.A'(P1) B16.B'(S1) B18.A'(P1) B18.B'(S1) B19.A'(P1) B19.B'(S1) B20.A'(P1) B20.B'(S1) B21.A'(P1) B21.B'(S1) B22.A'(P1) B22.B'(S1) B23.A'(P1) B23.B'(S1) B24.A'(P1) B24.B'(S1) B25.A'(P1) B25.B'(S1) B26.A'(P1) B26.B'(S1) B27.A'(P1) B27.B'(S1) B28.A'(P1) B28.B'(S1) B29.A'(P1) B29.B'(S1) B30.A'(P1) B30.B'(S1) B31.A'(P1) B31.B'(S1) B32.A'(P1) B32.B'(S1) B33.A'(P1) B33.B'(S1) B34.A'(P1) B34.B'(S1) B35.A'(P1) B35.B'(S1) B36.A'(P1) B36.B'(S1) B38.A'(P1) B38.B'(S1) B39.A'(P1) B39.B'(S1) B40.A'(P1) B40.B'(S1) B41.A'(P1) B41.B'(S1) B42.A'(P1) B42.B'(S1) B43.A'(P1) B43.B'(S1) B44.A'(P1) B44.B'(S1) B45.A'(P1) B45.B'(S1) B46.A'(P1) B46.B'(S1) B47.A'(P1) B47.B'(S1) B48.A'(P1) B48.B'(S1) B49.A'(P1) B49.B'(S1) B50.A'(P1) B50.B'(S1) B51.A'(P1) B51.B'(S1) B52.A'(P1) B52.B'(S1) B53.A'(P1) B53.B'(S1) B54.A'(P1) B54.B'(S1) B55.A'(P1) B55.B'(S1) B56.A'(P1) B56.B'(S1) B57.A'(P1) B57.B'(S1) B58.A'(P1) B58.B'(S1) B59.A'(P1) B59.B'(S1) B60.A'(P1) B60.B'(S1) N37.A'(P1) N37.B'(S1)

## Library data of the parts
$$PCB100 = e14_Rpi_Compute_RevB:RPI_COMPUTE: Device for a Raspberry PI Compute module. Note that the package is for a DDR2 connector of 'standard' orientation. Example: TE Connectivity P/N: 1565917-4, Newark P/N: 08P0616, Farnell P/N: 2112525 More information is available at http://www.element14.com/community/community/raspberry-pi/raspberry-pi-compute-module
$$U$1 = adafruit:FIDUCIAL: For use by pick and place machines to calibrate the vision/machine, 1mm By microbuilder.eu
B1-B16 B18-B36 B38-B60 N37 = microbuilder:SWITCH_TACT_SMT: SMT Tact Switches 6x6mm - Digikey: P12940SCT-ND KMR2 (4.6x2.8mm) - Digikey: 401-1426-1-ND EVQ-PQHB55 - Light Touch, 160GF (4.5x4.5mm) - Digikey: P8090SCT-ND
B17 = switch-tact_v1-0:SKQU
C1 = BaseApp:CAPACITOR: Film Capacitor, 400V. Mouser Part No :- __ECQ-E4474KF__
C2-C4 C6-C24 = resistor:C-EU: CAPACITOR, European symbol
D1-D16 D18-D60 = adafruit:DIODE: Diode SMADIODE - SMA Surface Mount Package 20V 1A Schottky Diode Digikey: 641-1014-6-ND DO-1N4148 - Through Hole Small Current Diode SOD-123 20V 1 A (.5mV Vf) Schottky Diode - Digikey: MBRX120TPMSCT-ND SOD-323 10V 570mA (.38mV Vf, 3ns) Schottky Diode - Digikey: ZLLS410CT-ND SOD-523 30V 30mA Schottky Diode (RB751S-40TE61) - Digikey: RB751S-40TE61CT-ND SOT23-R/W - SOT23 Package (R = Solder Paste/Reflow Ovens, W = Hand-Soldering) BAT54Film 40V 300mA - Digikey: 497-7162-1-ND
F1 = RaspberryPi_Compute:MF-MSMF200
J1-J11 = BaseApp:JUMPER
J12 = con-yamaichi:USB-A003: USB connector; OC_FARNELL: unknown; OC_NEWARK: unknown
JP1 = adafruit:PINHD-1X3: PIN HEADER
JP2 = ComputeCalculator:1X7-BIG
L1 L2 = resistor:L-US: INDUCTOR, American symbol
LED1 = led:LED: LED OSRAM: - CHIPLED LG R971, LG N971, LY N971, LG Q971, LY Q971, LO R971, LY R971 LH N974, LH R974 LS Q976, LO Q976, LY Q976 LO Q996 - Hyper CHIPLED LW Q18S LB Q993, LB Q99A, LB R99A - SideLED LS A670, LO A670, LY A670, LG A670, LP A670 LB A673, LV A673, LT A673, LW A673 LH A674 LY A675 LS A676, LA A676, LO A676, LY A676, LW A676 LS A679, LY A679, LG A679 - Hyper Micro SIDELED® LS Y876, LA Y876, LO Y876, LY Y876 LT Y87S - SmartLED LW L88C, LW L88S LB L89C, LB L89S, LG L890 LS L89K, LO L89K, LY L89K LS L896, LA L896, LO L896, LY L896 - TOPLED LS T670, LO T670, LY T670, LG T670, LP T670 LSG T670, LSP T670, LSY T670, LOP T670, LYG T670 LG T671, LOG T671, LSG T671 LB T673, LV T673, LT T673, LW T673 LH T674 LS T676, LA T676, LO T676, LY T676, LB T676, LH T676, LSB T676, LW T676 LB T67C, LV T67C, LT T67C, LS T67K, LO T67K, LY T67K, LW E67C LS E67B, LA E67B, LO E67B, LY E67B, LB E67C, LV E67C, LT E67C LW T67C LS T679, LY T679, LG T679 LS T770, LO T770, LY T770, LG T770, LP T770 LB T773, LV T773, LT T773, LW T773 LH T774 LS E675, LA E675, LY E675, LS T675 LS T776, LA T776, LO T776, LY T776, LB T776 LHGB T686 LT T68C, LB T68C - Hyper Mini TOPLED® LB M676 - Mini TOPLED Santana® LG M470 LS M47K, LO M47K, LY M47K Source: http://www.osram.convergy.de LUXEON: - LUMILED® LXK2-PW12-R00, LXK2-PW12-S00, LXK2-PW14-U00, LXK2-PW14-V00 LXK2-PM12-R00, LXK2-PM12-S00, LXK2-PM14-U00 LXK2-PE12-Q00, LXK2-PE12-R00, LXK2-PE12-S00, LXK2-PE14-T00, LXK2-PE14-U00 LXK2-PB12-K00, LXK2-PB12-L00, LXK2-PB12-M00, LXK2-PB14-N00, LXK2-PB14-P00, LXK2-PB14-Q00 LXK2-PR12-L00, LXK2-PR12-M00, LXK2-PR14-Q00, LXK2-PR14-R00 LXK2-PD12-Q00, LXK2-PD12-R00, LXK2-PD12-S00 LXK2-PH12-R00, LXK2-PH12-S00 LXK2-PL12-P00, LXK2-PL12-Q00, LXK2-PL12-R00 Source: www.luxeon.com KINGBRIGHT: KA-3528ASYC Source: www.kingbright.com
Q1 = microbuilder:TRANSISTOR_NPN: NPN Transistor Transistor (NPN) 500mA 45V - BC817 [Digikey: 568-1631-1-ND] Transistor (NPN) 500mA 45V - BC817,215 [Mouser: 771-BC817-T/R] SOT23-R - SOT23 footprint optimised for use with solder paste and reflow ovens. SOT23-W - SOT23 footprint optimised for hand-soldering (larger pads).
R1-R18 = resistor:R-EU_: RESISTOR, European symbol
TFT1 = adafruit:DISP_LCD_CTP28: 2.83" 240x320 Pixel Capacitive Touch Display
U1 = RaspberryPi_Compute:MIC5225
U2 = RaspberryPi_Compute:PAM2306AYPKE
U3 = RaspberryPi_Compute:AP7115-25SEG
U4 = adafruit:AXP083
UTSC = RaspberryPi_Compute:STMPE811